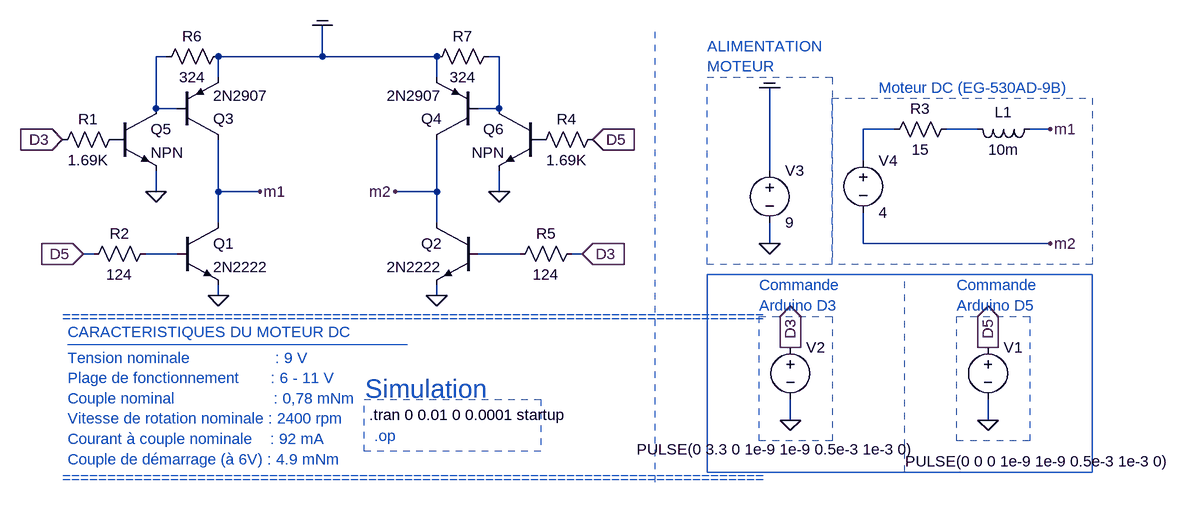
[diagram p0: schematic commande_moteur_DC.asc]
commande_moteur_DC.asc, the LTspice schematic file:
Version 4.1
SHEET 1 1860 680
WIRE 48 -32 32 -32
WIRE 288 -32 288 -80
WIRE 288 -32 128 -32
WIRE 464 -32 288 -32
WIRE 560 -32 544 -32
WIRE 128 0 128 -32
WIRE 464 0 464 -32
WIRE 32 48 32 -32
WIRE 64 48 32 48
WIRE 560 48 560 -32
WIRE 560 48 528 48
WIRE 1168 80 1120 80
WIRE 1296 80 1248 80
WIRE 1408 80 1376 80
WIRE 1120 128 1120 80
WIRE 976 144 976 16
WIRE 32 176 32 144
WIRE 128 176 128 96
WIRE 192 176 128 176
WIRE 464 176 464 96
WIRE 464 176 400 176
WIRE 560 176 560 144
WIRE 128 224 128 176
WIRE 464 224 464 176
WIRE 976 256 976 224
WIRE 1120 256 1120 208
WIRE 1408 256 1120 256
WIRE -64 272 -80 272
WIRE 64 272 16 272
WIRE 592 272 528 272
WIRE 688 272 672 272
WIRE 128 336 128 320
WIRE 464 336 464 320
WIRE 1008 528 1008 496
WIRE 1312 528 1312 496
FLAG 1312 528 0
FLAG 128 336 0
FLAG 464 336 0
FLAG 1008 528 0
FLAG 976 256 0
FLAG 32 176 0
FLAG 560 176 0
FLAG 288 -80 COM
FLAG 976 16 COM
FLAG 1008 416 D3
IOPIN 1008 416 Out
FLAG 1312 416 D5
IOPIN 1312 416 Out
FLAG -112 96 D3
IOPIN -112 96 In
FLAG 688 272 D3
IOPIN 688 272 In
FLAG -80 272 D5
IOPIN -80 272 In
FLAG 704 96 D5
IOPIN 704 96 In
FLAG 192 176 m1
FLAG 400 176 m2
FLAG 1408 80 m1
FLAG 1408 256 m2
SYMBOL voltage 1312 400 R0
WINDOW 3 -127 191 Left 2
WINDOW 123 0 0 Left 0
WINDOW 39 0 0 Left 0
SYMATTR Value PULSE(0 0 0 1e-9 1e-9 0.5e-3 1e-3 0)
SYMATTR InstName V1
SYMBOL res -16 80 R90
WINDOW 0 0 56 VBottom 2
WINDOW 3 32 56 VTop 2
SYMATTR InstName R1
SYMATTR Value 1.69K
SYMATTR SpiceLine tol=1 pwr=0.1
SYMBOL res 32 256 R90
WINDOW 0 0 56 VBottom 2
WINDOW 3 32 56 VTop 2
SYMATTR InstName R2
SYMATTR Value 124
SYMATTR SpiceLine tol=1 pwr=0.1
SYMBOL res 1264 64 R90
WINDOW 0 0 56 VBottom 2
WINDOW 3 32 56 VTop 2
SYMATTR InstName R3
SYMATTR Value 15
SYMBOL ind 1392 64 R90
WINDOW 0 5 56 VBottom 2
WINDOW 3 32 56 VTop 2
SYMATTR InstName L1
SYMATTR Value 10m
SYMBOL res 720 80 R90
WINDOW 0 0 56 VBottom 2
WINDOW 3 32 56 VTop 2
SYMATTR InstName R4
SYMATTR Value 1.69K
SYMATTR SpiceLine tol=1 pwr=0.1
SYMBOL res 688 256 R90
WINDOW 0 0 56 VBottom 2
WINDOW 3 32 56 VTop 2
SYMATTR InstName R5
SYMATTR Value 124
SYMATTR SpiceLine tol=1 pwr=0.1
SYMBOL voltage 1008 400 R0
WINDOW 3 195 173 Right 2
WINDOW 123 0 0 Left 0
WINDOW 39 0 0 Left 0
SYMATTR Value PULSE(0 3.3 0 1e-9 1e-9 0.5e-3 1e-3 0)
SYMATTR InstName V2
SYMBOL voltage 976 128 R0
WINDOW 123 0 0 Left 0
WINDOW 39 0 0 Left 0
SYMATTR InstName V3
SYMATTR Value 9
SYMBOL npn 64 224 R0
SYMATTR InstName Q1
SYMATTR Value 2N2222
SYMBOL npn 528 224 M0
SYMATTR InstName Q2
SYMATTR Value 2N2222
SYMBOL pnp 64 96 M180
SYMATTR InstName Q3
SYMATTR Value 2N2907
SYMBOL pnp 528 96 R180
SYMATTR InstName Q4
SYMATTR Value 2N2907
SYMBOL npn -32 48 R0
SYMATTR InstName Q5
SYMBOL npn 624 48 M0
SYMATTR InstName Q6
SYMBOL res 144 -48 R90
WINDOW 0 0 56 VBottom 2
WINDOW 3 32 56 VTop 2
SYMATTR InstName R6
SYMATTR Value 324
SYMATTR SpiceLine tol=1 pwr=0.1
SYMBOL res 560 -48 R90
WINDOW 0 0 56 VBottom 2
WINDOW 3 32 56 VTop 2
SYMATTR InstName R7
SYMATTR Value 324
SYMATTR SpiceLine tol=1 pwr=0.1
SYMBOL voltage 1120 112 R0
WINDOW 123 0 0 Left 0
WINDOW 39 0 0 Left 0
SYMATTR InstName V4
SYMATTR Value 4
TEXT 1144 16 Left 2 ;Moteur DC (EG-530AD-9B)
TEXT 1264 320 Left 2 ;Commande\nArduino D5
TEXT -112 368 Left 2 ;==============================================================================
TEXT -104 392 Left 2 ;CARACTERISTIQUES DU MOTEUR DC
TEXT -104 400 Left 2 ;________________________________________
TEXT -104 432 Left 2 ;Tension nominale                   : 9 V\nPlage de fonctionnement       : 6 - 11 V\nCouple nominal                      : 0,78 mNm\nVitesse de rotation nominale : 2400 rpm\nCourant à couple nominale    : 92 mA\nCouple de démarrage (à 6V) : 4.9 mNm
TEXT -112 616 Left 2 ;==============================================================================
TEXT 960 320 Left 2 ;Commande\nArduino D3
TEXT 360 520 Left 2 !.tran 0 0.01 0 0.0001 startup
TEXT 368 552 Left 2 ;.op
TEXT 880 -48 Left 2 ;ALIMENTATION\nMOTEUR
TEXT 448 480 Center 4 ;Simulation
LINE Normal 800 624 800 -80 2
LINE Normal 1184 608 1184 304 2
RECTANGLE Normal 1376 560 1264 368 2
RECTANGLE Normal 1072 560 960 368 2
RECTANGLE Normal 624 576 352 496 2
RECTANGLE Normal 1072 288 880 0 2
RECTANGLE Normal 1472 608 880 304
RECTANGLE Normal 1472 288 1072 32 2

The netlist it stands for:
* commande_moteur_DC.asc
V1 D5 0 PULSE(0 0 0 1e-9 1e-9 0.5e-3 1e-3 0)
R1 P001 D3 1.69K tol=1 pwr=0.1
R2 N005 D5 124 tol=1 pwr=0.1
R3 N004 N003 15
L1 m1 N004 10m
R4 D5 P002 1.69K tol=1 pwr=0.1
R5 D3 N006 124 tol=1 pwr=0.1
V2 D3 0 PULSE(0 3.3 0 1e-9 1e-9 0.5e-3 1e-3 0)
V3 COM 0 9
Q1 m1 N005 0 0 2N2222
Q2 m2 N006 0 0 2N2222
Q3 m1 N001 COM 0 2N2907
Q4 m2 N002 COM 0 2N2907
Q5 N001 P001 0 0 NPN
Q6 N002 P002 0 0 NPN
R6 COM N001 324 tol=1 pwr=0.1
R7 N002 COM 324 tol=1 pwr=0.1
V4 N003 m2 4
.model NPN NPN
.model PNP PNP
.lib standard.bjt
* Moteur DC (EG-530AD-9B)
* Commande
* Arduino D5
* ==============================================================================
* CARACTERISTIQUES DU MOTEUR DC
* ________________________________________
* Tension nominale                   : 9 V
* Plage de fonctionnement       : 6 - 11 V
* Couple nominal                      : 0,78 mNm
* Vitesse de rotation nominale : 2400 rpm
* Courant à couple nominale    : 92 mA
* Couple de démarrage (à 6V) : 4.9 mNm
* ==============================================================================
* Commande
* Arduino D3
.tran 0 0.01 0 0.0001 startup
* .op
* ALIMENTATION
* MOTEUR
* Simulation
.backanno
.end